# Altium schematic sheet GPS_Traking_V1_1.SchDoc: GPS_Tracking
size A4
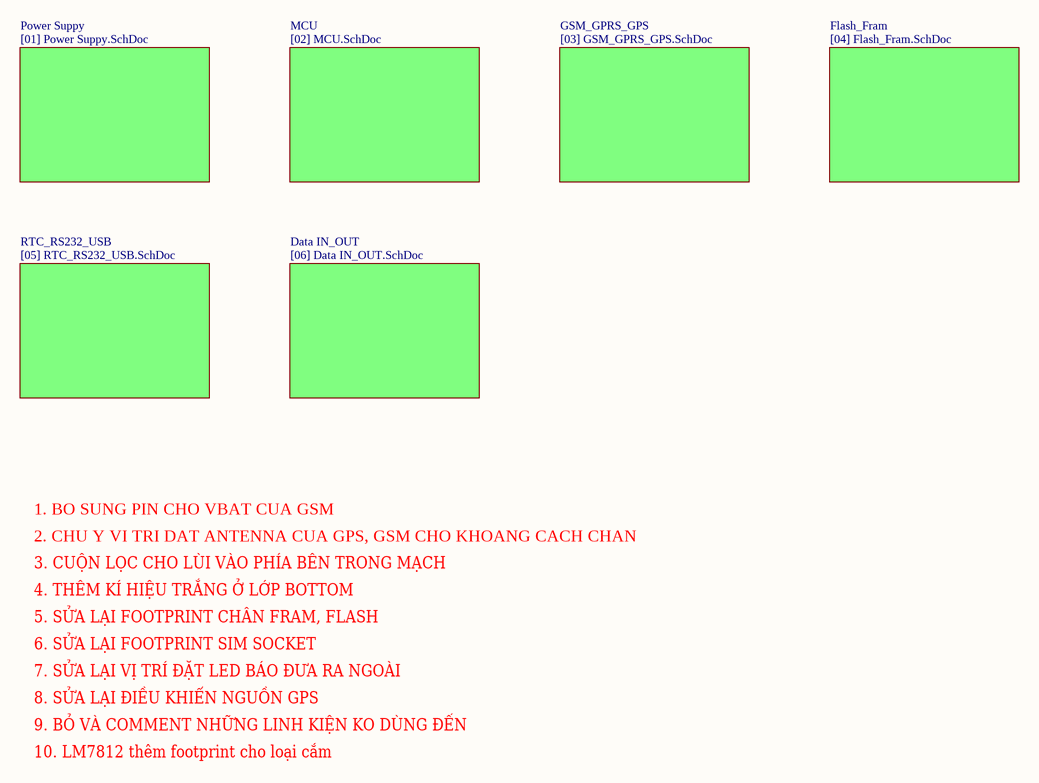
[diagram p0: GPS_Traking_V1_1.SchDoc]

## Sub-sheets
Data IN_OUT = [06] Data IN_OUT.SchDoc: no entries
Flash_Fram = [04] Flash_Fram.SchDoc: no entries
GSM_GPRS_GPS = [03] GSM_GPRS_GPS.SchDoc: no entries
MCU = [02] MCU.SchDoc: no entries
Power Suppy = [01] Power Suppy.SchDoc: no entries
RTC_RS232_USB = [05] RTC_RS232_USB.SchDoc: no entries

## Notes on the sheet
- 1. BO SUNG PIN CHO VBAT CUA GSM
- 2. CHU Y VI TRI DAT ANTENNA CUA GPS, GSM CHO KHOANG CACH CHAN
- 3. CUỘN LỌC CHO LÙI VÀO PHÍA BÊN TRONG MẠCH
- 4. THÊM KÍ HIỆU TRẮNG Ở LỚP BOTTOM
- 5. SỬA LẠI FOOTPRINT CHÂN FRAM, FLASH
- 6. SỬA LẠI FOOTPRINT SIM SOCKET
- 7. SỬA LẠI VỊ TRÍ ĐẶT LED BÁO ĐƯA RA NGOÀI
- 8. SỬA LẠI ĐIỀU KHIỂN NGUỒN GPS
- 9. BỎ VÀ COMMENT NHỮNG LINH KIỆN KO DÙNG ĐẾN
- 10. LM7812 thêm footprint cho loại cắm
- Title
- Size:
- Date:
- A4
- Number:
- Time:
- Revision:
- Sheet
- of
- File: